# Altium project StuderA80ReproExtend_V0.1.PrjPcb
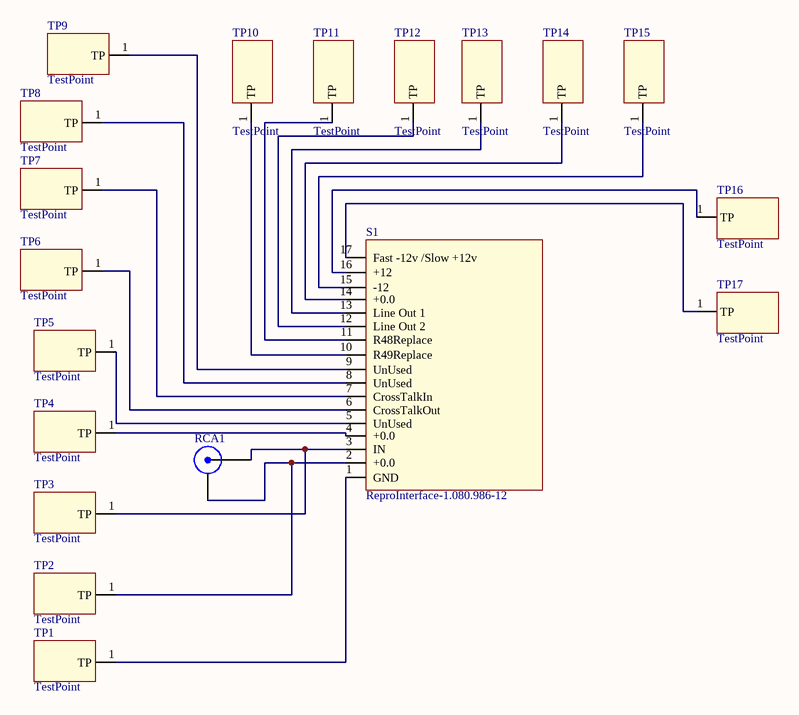
[diagram p0: StuderA80ReproExtend_V0.1.SchDoc]
1 sheet, 19 parts. Net scope: global (net labels, ports and power ports of the same name join across sheets).
Board file: StuderA80ReproExtend_V0.1.PcbDoc

## Sheet StuderA80ReproExtend_V0.1.SchDoc
size A4

### Parts
RCA1  RCA  [RCA-RJ255]  (value not drawn)
S1  ReproInterface-1.080.986-12  [ReproInterface]
TP1  TestPoint  [TP-1.0mm]
TP2  TestPoint  [TP-1.0mm]
TP3  TestPoint  [TP-1.0mm]
TP4  TestPoint  [TP-1.0mm]
TP5  TestPoint  [TP-1.0mm]
TP6  TestPoint  [TP-1.0mm]
TP7  TestPoint  [TP-1.0mm]
TP8  TestPoint  [TP-1.0mm]
TP9  TestPoint  [TP-1.0mm]
TP10  TestPoint  [TP-1.0mm]
TP11  TestPoint  [TP-1.0mm]
TP12  TestPoint  [TP-1.0mm]
TP13  TestPoint  [TP-1.0mm]
TP14  TestPoint  [TP-1.0mm]
TP15  TestPoint  [TP-1.0mm]
TP16  TestPoint  [TP-1.0mm]
TP17  TestPoint  [TP-1.0mm]

### Nets
NetRCA1_1: RCA1.1(X) S1.3(IN) TP3.1(TP)
NetRCA1_2: RCA1.2(Y) S1.2(+0.0) TP2.1(TP)
NetS1_1: S1.1(GND) TP1.1(TP)
NetS1_4: S1.4(+0.0) TP4.1(TP)
NetS1_5: S1.5(UnUsed) TP5.1(TP)
NetS1_6: S1.6(CrossTalkOut) TP6.1(TP)
NetS1_7: S1.7(CrossTalkIn) TP7.1(TP)
NetS1_8: S1.8(UnUsed) TP8.1(TP)
NetS1_9: S1.9(UnUsed) TP9.1(TP)
NetS1_10: S1.10(R49Replace) TP10.1(TP)
NetS1_11: S1.11(R48Replace) TP11.1(TP)
NetS1_12: S1.12(Line_Out_2) TP12.1(TP)
NetS1_13: S1.13(Line_Out_1) TP13.1(TP)
NetS1_14: S1.14(+0.0) TP14.1(TP)
NetS1_15: S1.15(-12) TP15.1(TP)
NetS1_16: S1.16(+12) TP16.1(TP)
NetS1_17: S1.17(Fast_-12v_/Slow_+12v) TP17.1(TP)

### Library data of the parts
RCA1 = RCA: RCA Connector; Revision: 17-Jul-2002: Re-released for DXP Platform.; Publisher: Altium Limited
S1 = ReproInterface-1.080.986-12: Studer A80 RC Reproduce Card 1.080.986-12 Interface